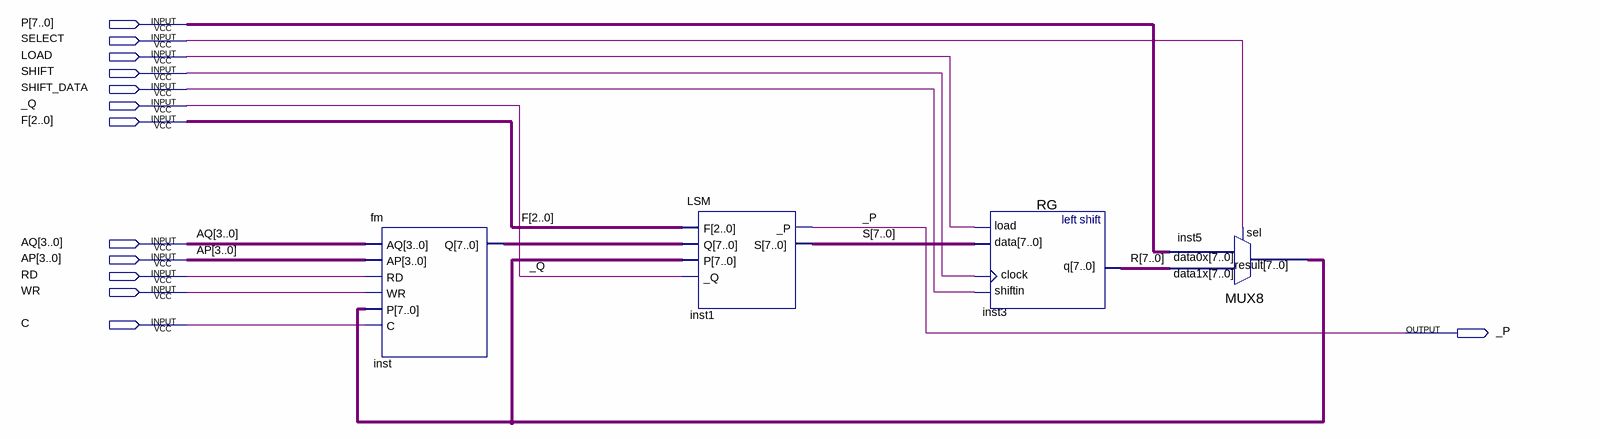
[diagram p0: schematic sheet]
// Quartus schematic AU.bdf as structural Verilog: 4 symbols, 13 pins
module AU (
  input  [7:0] P,
  input  SELECT,
  input  LOAD,
  input  SHIFT,
  input  SHIFT_DATA,
  input  _Q,
  input  [2:0] F,
  input  [3:0] AQ,
  input  [3:0] AP,
  input  RD,
  input  WR,
  input  C,
  output _P
);

  wire [7:0] inst5_result, inst_q, R, S;

  fm inst (.AQ(AQ), .AP(AP), .RD(RD), .WR(WR), .P(inst5_result), .C(C), .Q(inst_q));
  LSM inst1 (.F(F), .Q(inst_q), .P(inst5_result), ._Q(_Q), ._P(_P), .S(S));
  RG inst3 (.load(LOAD), .data(S), .clock(SHIFT), .shiftin(SHIFT_DATA), .q(R));
  MUX8 inst5 (.data1x(R), .data0x(P), .sel(SELECT), .result(inst5_result));
endmodule
